# Altium schematic sheet Alimentation.SchDoc
size A4; SheetNumber: 4; SheetTotal: 7
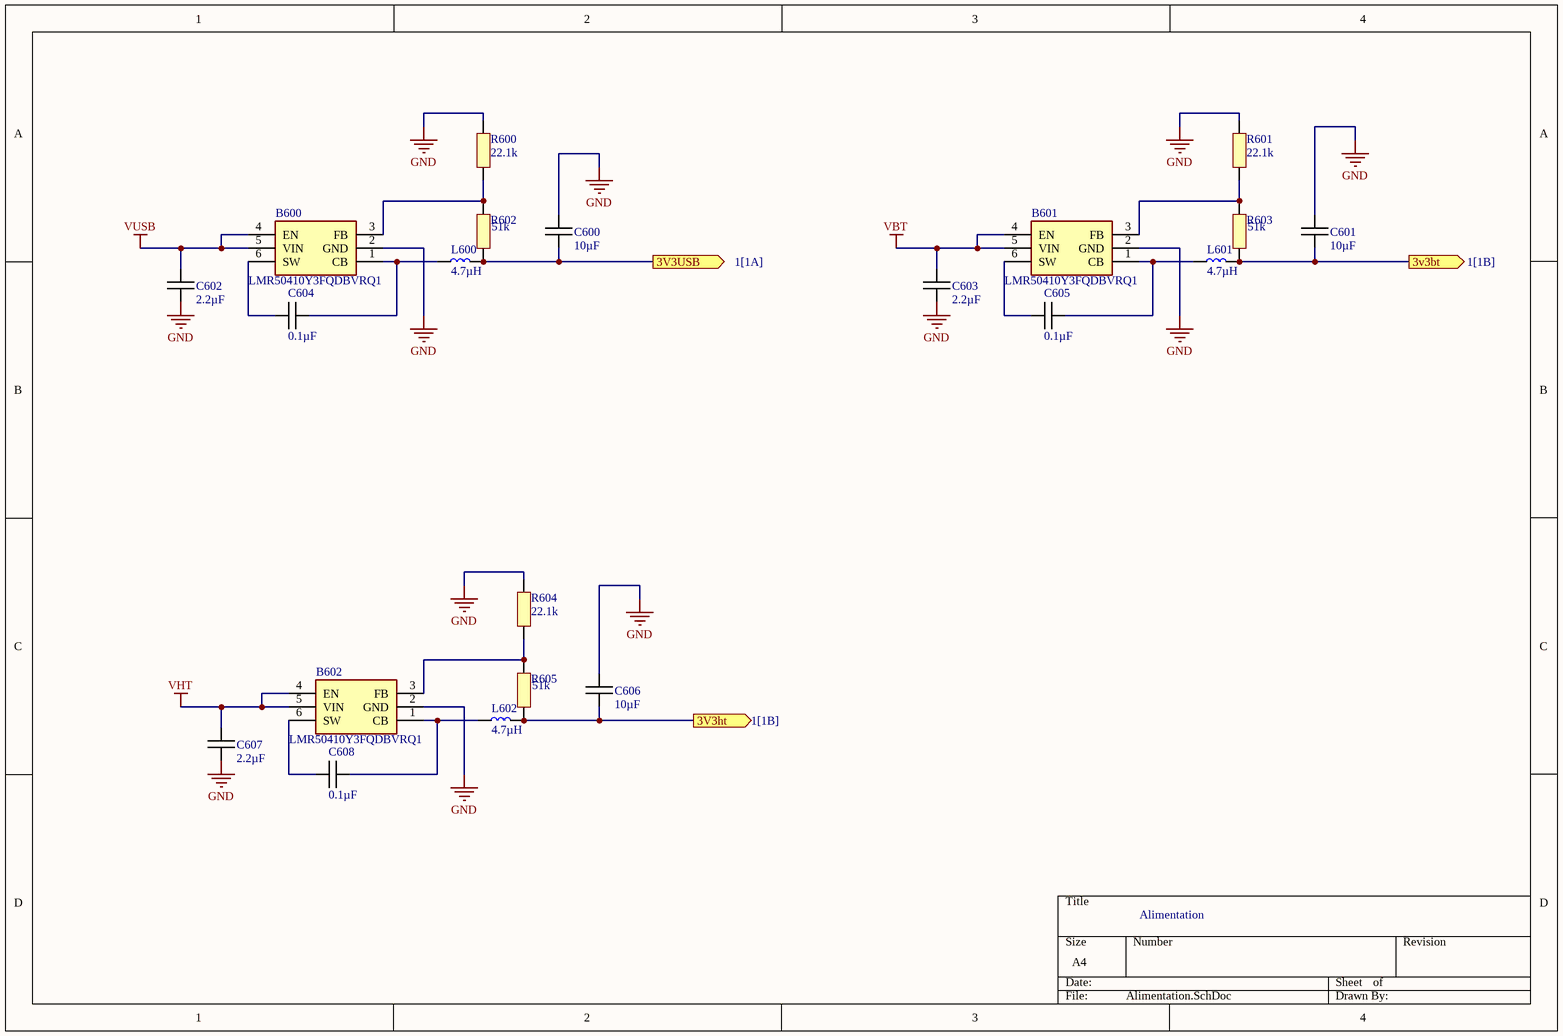
[diagram p0: Alimentation.SchDoc]

## Parts
B600  LMR50410Y3FQDBVRQ1  [SOT95P280X145-6N]
B601  LMR50410Y3FQDBVRQ1  [SOT95P280X145-6N]
B602  LMR50410Y3FQDBVRQ1  [SOT95P280X145-6N]
C600  10µF  [CAPC1005X06N]
C601  10µF  [CAPC1005X06N]
C602  2.2µF  [CAPC1005X06N]
C603  2.2µF  [CAPC1005X06N]
C604  0.1µF  [CAPC1005X06N]
C605  0.1µF  [CAPC1005X06N]
C606  10µF  [CAPC1005X06N]
C607  2.2µF  [CAPC1005X06N]
C608  0.1µF  [CAPC1005X06N]
L600  4.7µH  [LQPC1005X06N]
L601  4.7µH  [LQPC1005X06N]
L602  4.7µH  [LQPC1005X06N]
R600  22.1k  [RESC1005X06N]
R601  22.1k  [RESC1005X06N]
R602  51k  [RESC1005X06N]
R603  51k  [RESC1005X06N]
R604  22.1k  [RESC1005X06N]
R605  51k  [RESC1005X06N]

## Ports
3v3bt (out, see 1[1B]), 3V3ht (out, see 1[1B]), 3V3USB (out, see 1[1A])

## Nets
GND: B600.2(GND) B601.2(GND) B602.2(GND) C600.1 C601.1 C602.2 C603.2 C606.1 C607.2 R600.2 R601.2 R604.2
VBT: B601.4(EN) B601.5(VIN) C603.1
VHT: B602.4(EN) B602.5(VIN) C607.1
VUSB: B600.4(EN) B600.5(VIN) C602.1
3v3bt: C601.2 L601.2 R603.1 ; port 3v3bt
3V3ht: C606.2 L602.2 R605.1 ; port 3V3ht
3V3USB: C600.2 L600.2 R602.1 ; port 3V3USB
NetB600_1: B600.1(CB) C604.1 L600.1
NetB600_3: B600.3(FB) R600.1 R602.2
NetB600_6: B600.6(SW) C604.2
NetB601_1: B601.1(CB) C605.1 L601.1
NetB601_3: B601.3(FB) R601.1 R603.2
NetB601_6: B601.6(SW) C605.2
NetB602_1: B602.1(CB) C608.1 L602.1
NetB602_3: B602.3(FB) R604.1 R605.2
NetB602_6: B602.6(SW) C608.2

## Notes on the sheet
- Alimentation

## Library data of the parts
B600-B602 = LMR50410Y3FQDBVRQ1: Régulateurs de tension de commutation Automotive qualified SIMPLE SWITCHER 4-V to 36-V, 1-A synchronous step-down converter 6-SOT-23 -40 to 150; Manufacturer_Name: Texas Instruments; Manufacturer_Part_Number: LMR50410Y3FQDBVRQ1; Mouser Part Number: 595-R50410Y3FQDBVRQ1
C600-C608 = Capacitor
L600-L602 = Bobine
R600-R605 = Resistor